# EasyEDA Pro project STC8G1K08小工具.eprj

# Schematic Schematic1
Board Name: Board1; Create Date: 2025-07-21; Page Name: P1; Project Name: STC8G1K08小工具; Schematic Name: Schematic1; Update Date: 2025-07-21; Company: 嘉立创EDA; Page Size: A4; Version: V1.0
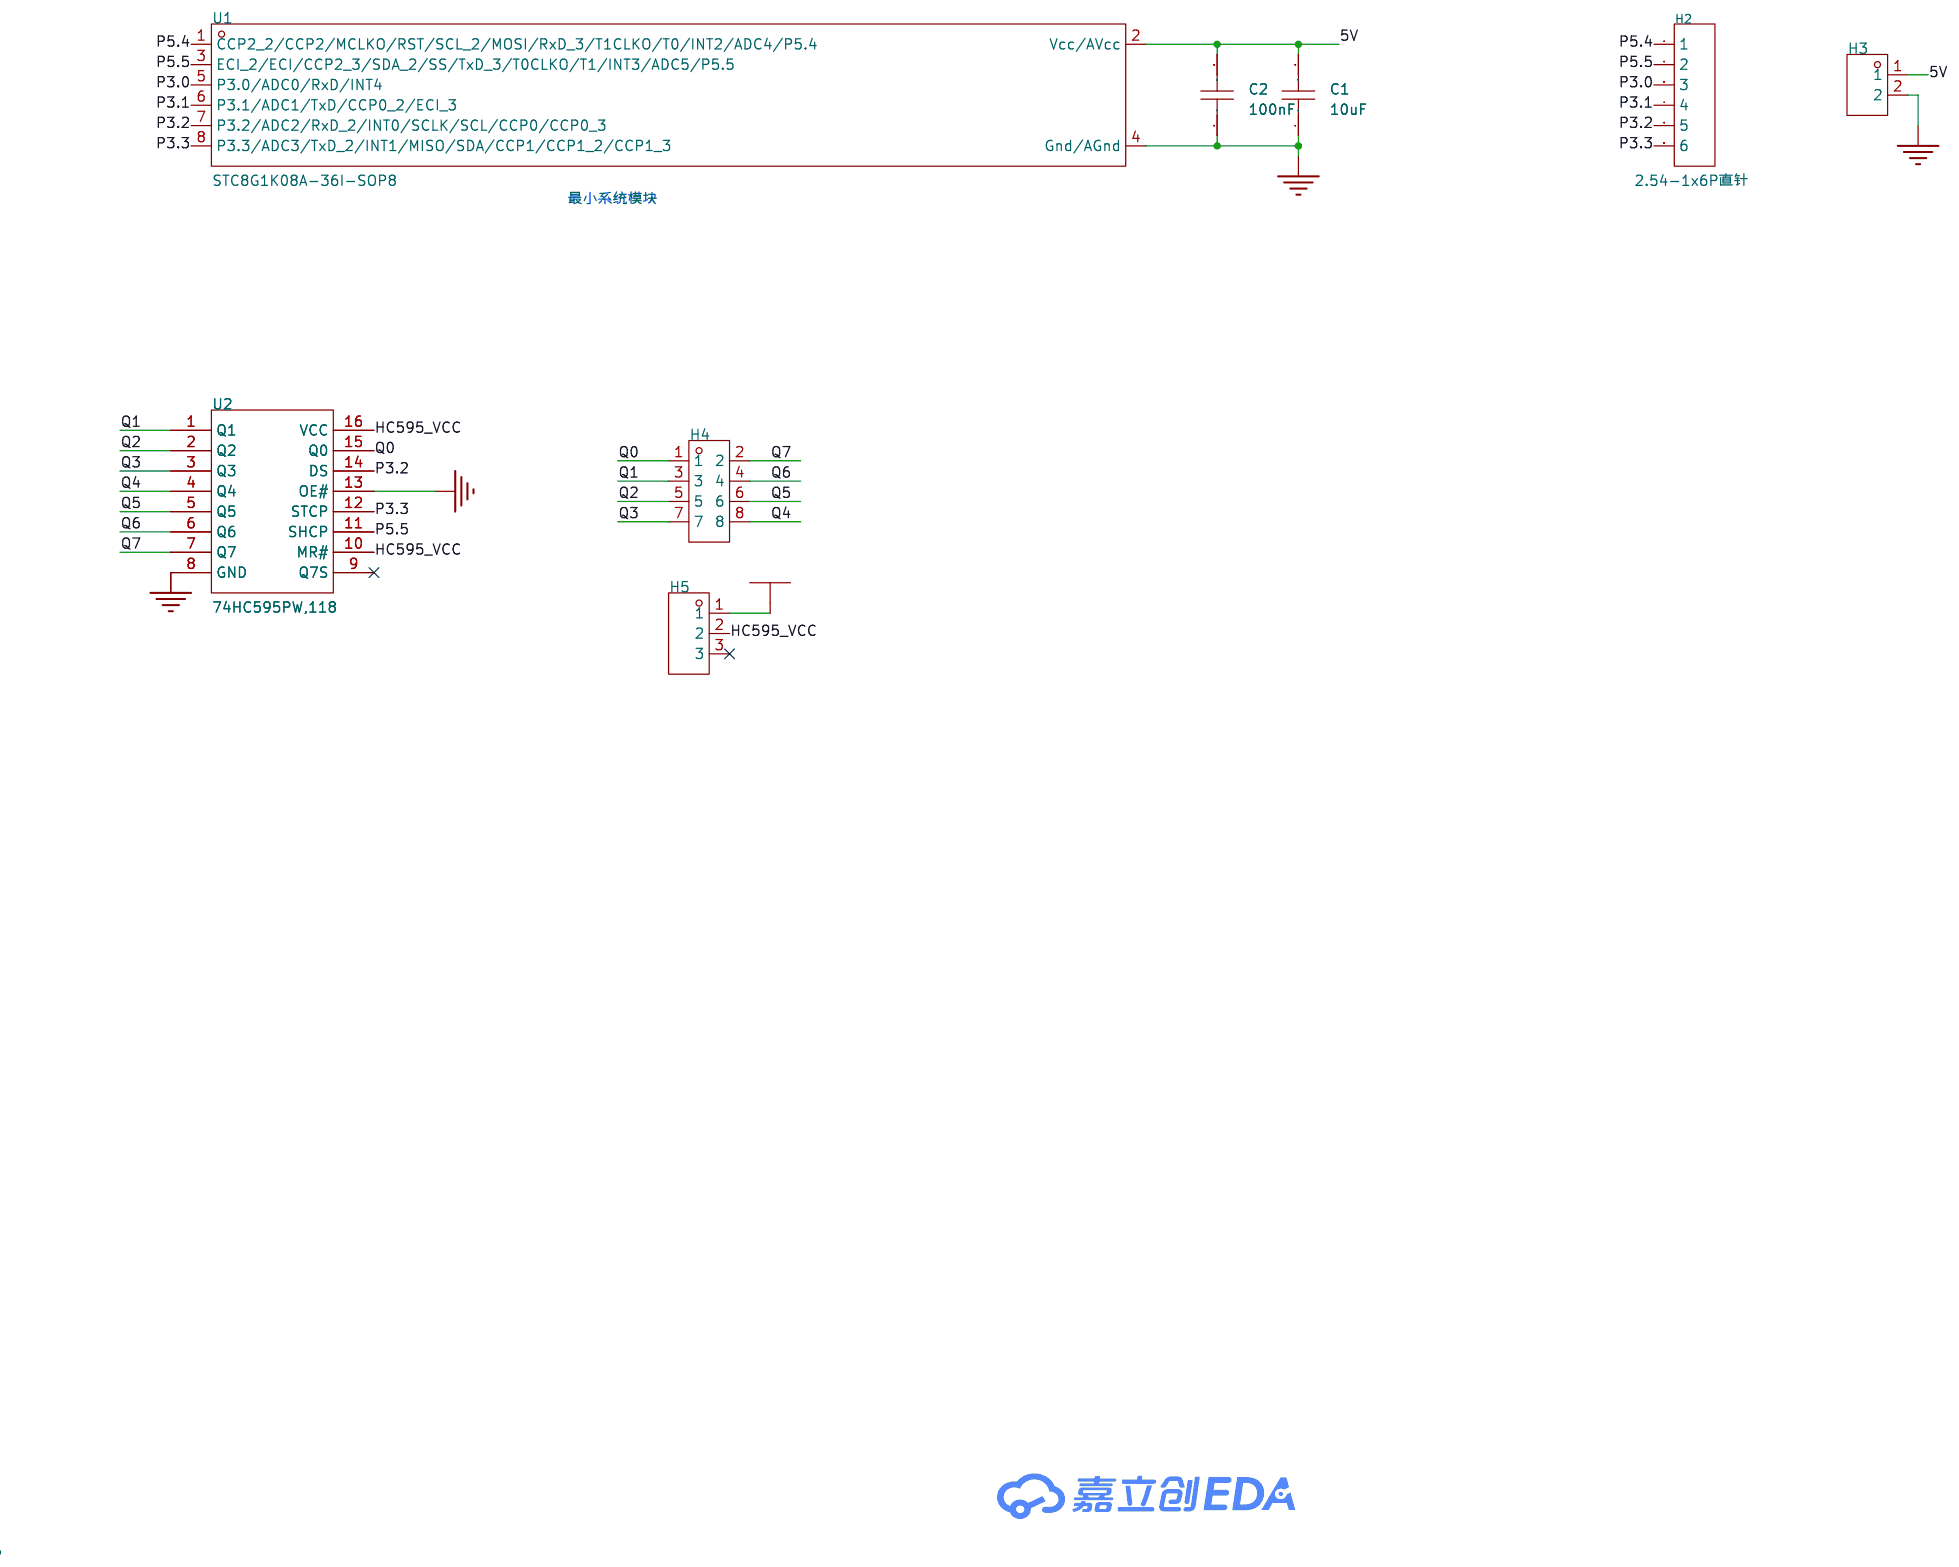
[diagram p0: schematic sheet]

## Parts
C1  10uF  [C0603]
C2  100nF  [C0603]
H2  2.54-1x6P直针  [HDR-TH_6P-P2.54-V-M-1]
H3  PZ254V-11-02P  [HDR-TH_2P-P2.54-V-M]
H4  PZ254V-12-8P  [HDR-TH_8P-P2.54-V-M-R2-C4-S2.54]
H5  PZ254V-11-03P  [HDR-TH_3P-P2.54-V-M]
U1  STC8G1K08A-36I-SOP8  [SOP-8_L5.0-W4.0-P1.27-LS6.0-BL]
U2  74HC595PW,118  [TSSOP-16_L5.0-W4.4-P0.65-LS6.4-BL]

## Library data of the parts
C1 = CL10A106KP8NNNC: LCSC Part Name: 10uF ±10% 10V; Supplier Part: C19702; Manufacturer: SAMSUNG(三星); Supplier Footprint: 0603; JLCPCB Part Class: Basic Part; Datasheet: https://atta.szlcsc.com/upload/public/pdf/source/20160103/1457707703378.pdf; Supplier: LCSC; Tolerance: ±10%; Voltage Rated: 10V; Temperature Coefficient: X5R
C2 = CC0603KRX7R9BB104: LCSC Part Name: 100nF ±10% 50V; Supplier Part: C14663; Manufacturer: YAGEO(国巨); Supplier Footprint: 0603; JLCPCB Part Class: Basic Part; Datasheet: https://atta.szlcsc.com/upload/public/pdf/source/20170116/1484561234239.pdf; Supplier: LCSC; Tolerance: ±10%; Voltage Rated: 50V; Temperature Coefficient: X7R
H2 = 2.54-1x6P直针: LCSC Part Name: 2.54mm 1x6P 直插 方针; Supplier Part: C37208; Manufacturer: BOOMELE(博穆精密); Supplier Footprint: 直插,P=2.54mm; JLCPCB Part Class: Extended Part; Datasheet: https://atta.szlcsc.com/upload/public/pdf/source/20151109/1457707558014.pdf; Supplier: LCSC; Pitch: 2.54mm; Number of Pins: 6; Number of Rows: 1; Pin Structure: 1x6P; Mounting Type: 直插; Circluar Pins/Square Pins: 方针; Current Rating (Max): 3A; Contact Material: 黄铜; Operating Temperature Range: -40℃~+105℃; Color: 黑色
H3 = PZ254V-11-02P: LCSC Part Name: 2.54mm 1x2P 直插 方针; Supplier Part: C492401; Manufacturer: XFCN(兴飞); Supplier Footprint: 插件,P=2.54mm; JLCPCB Part Class: Extended Part; Datasheet: https://atta.szlcsc.com/upload/public/pdf/source/20200309/C492401_A812433581A9B211A7FFA413ADDFF0E5.pdf; Supplier: LCSC; Pitch: 2.54mm; Number of Pins: 2; Number of Rows: 1; Pin Structure: 1x2P; Mounting Type: 直插; Circluar Pins/Square Pins: 方针; Length of Mating Pin: 6mm; Insulation Height: 2.5mm; Length of End Connection Pin: 3mm; Contact Material: 黄铜; Operating Temperature Range: -40℃~+105℃; Color: 黑色
H4 = PZ254V-12-8P: LCSC Part Name: 2.54mm 2x4P 直插 方针; Supplier Part: C492421; Manufacturer: XFCN(兴飞); Supplier Footprint: 直插,P=2.54mm; JLCPCB Part Class: Extended Part; Datasheet: https://atta.szlcsc.com/upload/public/pdf/source/20200309/C492421_DC8A206AF99CD7755BD4A5B0BC48200B.pdf; Supplier: LCSC; Pitch: 2.54mm; Number of Pins: 8; Number of Rows: 2; Pin Structure: 2x4P; Row Spacing: 2.54mm; Mounting Type: 直插; Circluar Pins/Square Pins: 方针; Length of Mating Pin: 6mm; Insulation Height: 2.5mm; Length of End Connection Pin: 3mm; Contact Material: 黄铜; Operating Temperature Range: -40℃~+105℃; Color: 黑色
H5 = PZ254V-11-03P: LCSC Part Name: 2.54mm 1x3P 直插 方针; Supplier Part: C492402; Manufacturer: XFCN(兴飞); Supplier Footprint: 插件,P=2.54mm; JLCPCB Part Class: Extended Part; Datasheet: https://atta.szlcsc.com/upload/public/pdf/source/20200309/C492402_8335C3D49C4E4C618838D59BB1D024C1.pdf; Supplier: LCSC; Pitch: 2.54mm; Number of Pins: 3; Number of Rows: 1; Pin Structure: 1x3P; Mounting Type: 直插; Circluar Pins/Square Pins: 方针; Length of Mating Pin: 6mm; Insulation Height: 2.5mm; Length of End Connection Pin: 3mm; Contact Material: 黄铜; Operating Temperature Range: -40℃~+105℃; Color: 黑色
U1 = STC8G1K08A-36I-SOP8: Supplier Part: C915663; Manufacturer: STC; Supplier Footprint: SOP-8; JLCPCB Part Class: 扩展库; Datasheet: https://atta.szlcsc.com/upload/public/pdf/source/20241226/1556D7EB67C0BC8C1661C3E278549CA4.pdf; Supplier: LCSC; CPU Core: 51系列; Program Storage Size: 8KB; Program Memory Type: FLASH; Number of I/O: 6; ADC (Bit): 10bit; Low Voltage Detection Threshold: 1.9V~5.5V
U2 = 74HC595PW,118: Supplier Part: C5948; Manufacturer: Nexperia(安世); Supplier Footprint: TSSOP-16; JLCPCB Part Class: Extended Part; Datasheet: https://atta.szlcsc.com/upload/public/pdf/source/20180816/C5948_F1853EC44A4F17655997C4FF6169FA63.pdf; Supplier: LCSC

## Nets
5V: C1.2 C2.2 H3.1 H5.1 U1.2(Vcc/AVcc)
GND: C1.1 C2.1 H3.2 U1.4(Gnd/AGnd) U2.8(GND) U2.13(OE#)
HC595_VCC: H5.2 U2.10(MR#) U2.16(VCC)
P3.0: H2.3 U1.5(P3.0/ADC0/RxD/INT4)
P3.1: H2.4 U1.6(P3.1/ADC1/TxD/CCP0_2/ECI_3)
P3.2: H2.5 U1.7(P3.2/ADC2/RxD_2/INT0/SCLK/SCL/CCP0/CCP0_3) U2.14(DS)
P3.3: H2.6 U1.8(P3.3/ADC3/TxD_2/INT1/MISO/SDA/CCP1/CCP1_2/CCP1_3) U2.12(STCP)
P5.4: H2.1 U1.1(CCP2_2/CCP2/MCLKO/RST/SCL_2/MOSI/RxD_3/T1CLKO/T0/INT2/ADC4/P5.4)
P5.5: H2.2 U1.3(ECI_2/ECI/CCP2_3/SDA_2/SS/TxD_3/T0CLKO/T1/INT3/ADC5/P5.5) U2.11(SHCP)
Q0: H4.1 U2.15(Q0)
Q1: H4.3 U2.1(Q1)
Q2: H4.5 U2.2(Q2)
Q3: H4.7 U2.3(Q3)
Q4: H4.8 U2.4(Q4)
Q5: H4.6 U2.5(Q5)
Q6: H4.4 U2.6(Q6)
Q7: H4.2 U2.7(Q7)

Not connected (* = marked no-connect by the designer): H5 3*; U2 9(Q7S)*

## Notes on the sheet
- 最小系统模块

# Board PCB1
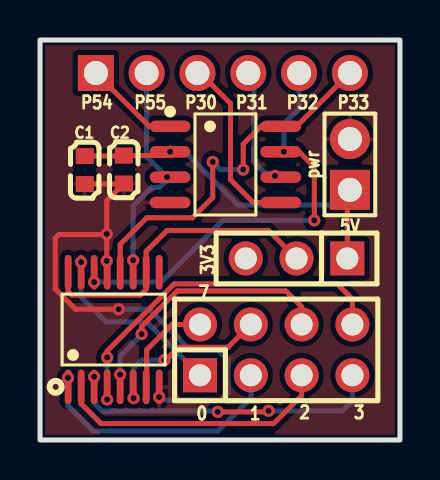
[diagram p1: board, top side]
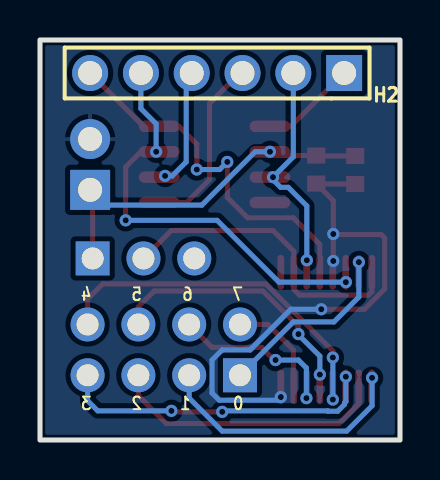
[diagram p2: board, bottom side, seen from below]

Outline 18 x 20 mm; copper layers: Top Layer, Bottom Layer. Coordinates in mm from the lower left corner of the outline.
Outline path: rectangle 0,20 18,0
Stack: Top Layer 0.035mm / Dielectric1 1.51mm FR4 er 4.5 / Bottom Layer 0.035mm

## Design rules (mm)
template: JLCPCB Capability(Two Layers Board)
spacing copperThickness1oz (default): track to track 0.102, other pairs 0.152 to 0.3
spacing copperThickness2oz: track to track 0.203, other pairs 0.152 to 0.3
track width copperThickness1oz (default): min 0.127, default 0.254, max 2.54
track width copperThickness2oz: min 0.203, default 0.254, max 2.54
differential pair differentialPair (default): width min 0.127, default 0.254, max 2.54; gap min 0.152, default 0.152
via viaSize (default): diameter min 0.5, default 0.61, max 10; hole min 0.3, default 0.305, max 6.3

## Placement (name value [footprint] x y rotation side)
C1  10uF  [C0603]  2.24 13.5 90 top
C2  100nF  [C0603]  4.19 13.52 90 top
H2  2.54-1x6P直针  [HDR-TH_6P-P2.54-V-M-1]  9.14 18.35 0 bottom
H3  PZ254V-11-02P  [HDR-TH_2P-P2.54-V-M]  15.49 13.78 90 top
H4  PZ254V-12-8P  [HDR-TH_8P-P2.54-V-M-R2-C4-S2.54]  11.81 4.51 0 top
H5  PZ254V-11-03P  [HDR-TH_3P-P2.54-V-M]  12.83 9.08 180 top
U1  STC8G1K08A-36I-SOP8  [SOP-8_L5.0-W4.0-P1.27-LS6.0-BL]  9.27 13.78 270 top
U2  74HC595PW,118  [TSSOP-16_L5.0-W4.4-P0.65-LS6.4-BL]  3.68 5.52 0 top

## Footprints (pads in the part's own frame, mm; a bottom-side part is the same pattern mirrored in y, then rotated)
C0603
  rect 0.8x0.9 smd: 1(-0.7,0) 2(0.7,0)
HDR-TH_2P-P2.54-V-M
  rect 2x2 hole 1.2: 1(-1.27,0)
  round 2 hole 1.2: 2(1.27,0)
HDR-TH_3P-P2.54-V-M
  rect 1.7x1.7 hole 1.1: 1(-2.54,0)
  round 1.7 hole 1.1: 2(0,0) 3(2.54,0)
HDR-TH_6P-P2.54-V-M-1
  rect 1.8x1.8 hole 1.2: 1(-6.35,0)
  round 1.8 hole 1.2: 2(-3.81,0) 3(-1.27,0) 4(1.27,0) 5(3.81,0) 6(6.35,0)
HDR-TH_8P-P2.54-V-M-R2-C4-S2.54
  rect 1.7x1.7 hole 1.1: 1(-3.81,-1.27)
  round 1.7 hole 1.1: 2(-3.81,1.27) 3(-1.27,-1.27) 4(-1.27,1.27) 5(1.27,-1.27) 6(1.27,1.27) 7(3.81,-1.27) 8(3.81,1.27)
SOP-8_L5.0-W4.0-P1.27-LS6.0-BL
  oval 0.574x2.035 smd: 1(-1.905,-2.768) 2(-0.635,-2.768) 3(0.635,-2.768) 4(1.905,-2.768) 5(1.905,2.768) 6(0.635,2.768) 7(-0.635,2.768) 8(-1.905,2.768)
TSSOP-16_L5.0-W4.4-P0.65-LS6.4-BL
  oval 0.343x1.732 smd: 1(-2.276,-2.865) 2(-1.625,-2.865) 3(-0.976,-2.865) 4(-0.325,-2.865) 5(0.325,-2.865) 6(0.976,-2.865) 7(1.625,-2.865) 8(2.276,-2.865) 9(2.276,2.865) 10(1.625,2.865) 11(0.976,2.865) 12(0.325,2.865) 13(-0.325,2.865) 14(-0.976,2.865) 15(-1.625,2.865) 16(-2.276,2.865)

## Nets
As in the schematic.

Pads without a net: H5 3; U2 9

## Via types
v1: diameter 0.61, hole 0.305, Top Layer to Bottom Layer, 24 vias

## Routing (per net, layer and track width the routed paths; a pad name or vN(x,y) marks a point on that pad's centre or on a via; arc(x,y) is an arc through that point)
5V: length 18.5
  Top Layer w0.254: H5.1 15.37,12.38 H3.1 ; C1.2 4.17,14.2 C2.2 6.31,14.22 v1(6.5,14.41)
  Bottom Layer w0.254: v1(6.5,14.41) 7.24,14.41 9.91,11.75 15.24,11.75 15.49,12 H3.1
GND: length 26.8
  Top Layer w0.254: v1(3.94,6.54) 1.78,6.54 0.76,7.55 0.76,10.09 0.94,10.27 3.31,10.27 v1(3.34,10.3) ; 4.17,12.8 3.34,11.97 v1(3.34,10.3) ; 4.17,12.8 C1.1 ; 4.17,12.8 C2.1 ; v1(3.34,10.3) v1(3.34,8.95)
  Bottom Layer w0.254: v1(5.96,2.15) 6.12,1.99 9.04,1.99 9.4,2.35 9.4,4 8.89,4.51 7.49,4.51 5.46,6.54 v1(3.94,6.54)
HC595_VCC: length 15.5
  Top Layer w0.254: H5.2 11.43,10.47 6.35,10.47 5.31,9.43 U2.10 5.31,7.53 5.02,7.24 1.58,7.24 1.41,7.42 1.41,8.39
P3.0: length 9.1
  Top Layer w0.254: U1.5 10.67,11.87 9.53,13.02 9.53,16.83 8.25,18.09 8.13,18.09 H2.3
P3.1: length 5.9
  Bottom Layer w0.254: v1(11.75,13.21) 11.39,13.21 10.69,13.9 10.69,18.09 10.44,18.35 H2.4
P3.2: length 21
  Top Layer w0.254: v1(13.72,10.98) 13.72,13.65 12.95,14.41 v1(12.19,14.41)
  Bottom Layer w0.254: v1(2.71,7.89) 6.05,7.89 9.14,10.98 v1(13.72,10.98) ; H2.5 12.95,16.57 12.19,15.81 v1(12.19,14.41)
P3.3: length 18.5
  Top Layer w0.254: H2.6 12.83,15.68 U1.8 11.05,15.68 10.16,14.79 v1(10.16,13.52) ; U2.12 4.01,9.78 5.33,11.11 7.62,11.11 8.64,12.13 v1(8.64,13.9)
  Bottom Layer w0.254: v1(8.64,13.9) 9.02,13.52 v1(10.16,13.52)
P5.4: length 4.8
  Top Layer w0.254: H2.1 5.46,15.68 U1.1
P5.5: length 10.7
  Bottom Layer w0.254: H2.2 5.33,14.16 v1(6.35,13.14) 6.35,13.02 5.97,12.63 5.59,12.63 4.66,11.7 v1(4.66,8.99)
Q0: length 9.3
  Bottom Layer w0.254: H4.1 5.33,5.9 3.3,5.9 2.06,7.15 v1(2.06,8.89)
Q1: length 12.9
  Bottom Layer w0.254: v1(1.4,3.11) 1.4,1.71 2.67,0.44 8.89,0.44 10.54,2.09 H4.3
Q2: length 13.9
  Top Layer w0.254: 13.08,3.24 13.08,2.22 11.68,0.82 3.05,0.82 2.06,1.81 2.06,2.66
Q3: length 15.9
  Top Layer w0.254: v1(8.89,1.41) 11.38,1.41 v1(11.43,1.46)
  Bottom Layer w0.254: v1(8.89,1.41) 8.84,1.46 3.62,1.46 3.6,1.44 3.12,1.44 2.77,1.78 2.77,1.86 2.71,1.93 v1(2.71,3.17) ; v1(11.43,1.46) 15.11,1.46 15.62,1.97 H4.7
Q4: length 17.7
  Top Layer w0.254: v1(3.36,4.12) 3.36,4.45 6.71,7.81 14.86,7.81 15.62,7.05 H4.8
  Bottom Layer w0.254: v1(3.36,2.02) v1(3.36,4.12)
Q5: length 12.8
  Top Layer w0.254: v1(5.08,5.3) 5.08,5.67 6.86,7.45 12.29,7.45 13.08,6.67 13.08,5.78
  Bottom Layer w0.254: v1(4.01,3.27) 4.01,4.2 5.08,5.27 v1(5.08,5.3)
Q6: length 8.3
  Top Layer w0.254: v1(6.22,4) 6.29,4 6.93,4.63 9.4,4.63 H4.4
  Bottom Layer w0.254: v1(6.22,4) 5.08,4 4.68,3.6 v1(4.68,2.09)
Q7: length 5.1
  Top Layer w0.254: 5.31,2.66 5.33,2.68 5.33,4.51 6.6,5.78 H4.2

## Copper pours and planes (outline as drawn; the poured copper is in the pictures)
GND on Top Layer: -1.14,20.89 18.54,20.89 18.54,-0.95 -1.14,-0.95
GND on Bottom Layer: -1.91,21.91 19.69,21.91 19.69,-1.84 -1.91,-1.84

## Text on the board
Bottom Silkscreen Layer: 0 | 7 | 6 | 1 | 5 | 2 | 4 | 3
Top Silkscreen Layer: P54 | P55 | P30 | 0 | 7 | P31 | 1 | P32 | 2 | P33 | 5V | 3 | 3V3 | pwr
